# Altium schematic sheet Transceiver.SchDoc
size A4
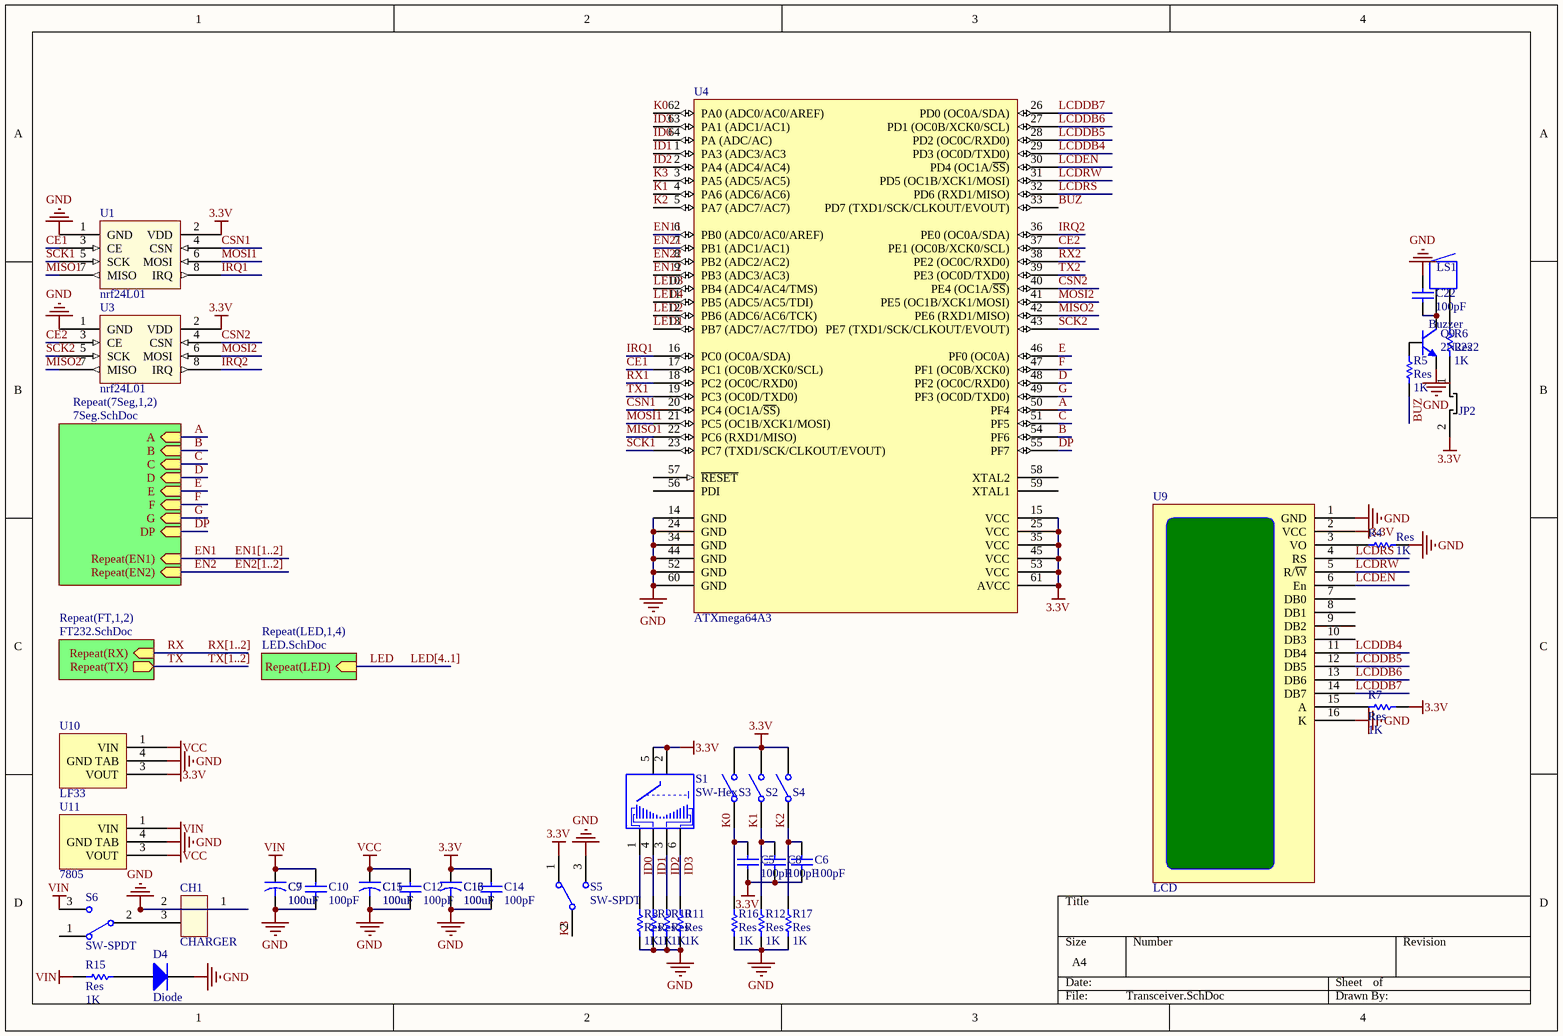
[diagram p0: Transceiver.SchDoc]

## Parts
C5  value 100pF  [2012[0805]]  (hidden comment: Cap_UP)
C6  value 100pF  [2012[0805]]  (hidden comment: Cap_UP)
C7  value 100uF  [EL_M]  (hidden comment: Cap_El)
C8  value 100pF  [2012[0805]]  (hidden comment: Cap_UP)
C9  value 100uF  [EL_M]  (hidden comment: Cap_El)
C10  value 100pF  [2012[0805]]  (hidden comment: Cap_UP)
C11  value 100uF  [EL_M]  (hidden comment: Cap_El)
C12  value 100pF  [2012[0805]]  (hidden comment: Cap_UP)
C13  value 100uF  [EL_M]  (hidden comment: Cap_El)
C14  value 100pF  [2012[0805]]  (hidden comment: Cap_UP)
C15  value 100uF  [EL_M]  (hidden comment: Cap_El)
C16  value 100uF  [EL_M]  (hidden comment: Cap_El)
C22  value 100pF  [2012[0805]]  (hidden comment: Cap_UP)
CH1  CHARGER  [CHARGER]
D4  Diode  [2012[0805]]
JP2  JUMPER  [HDR1X2]  (value not drawn)
LS1  Buzzer  [BUZZER]
Q9  2N2222  [SOT-23]
R4  Res  value 1K  [2012[0805]]
R5  Res  value 1K  [2012[0805]]
R6  Res  value 1K  [2012[0805]]
R7  Res  value 1K  [2012[0805]]
R8  Res  value 1K  [2012[0805]]
R9  Res  value 1K  [2012[0805]]
R10  Res  value 1K  [2012[0805]]
R11  Res  value 1K  [2012[0805]]
R12  Res  value 1K  [2012[0805]]
R15  Res  value 1K  [2012[0805]]
R16  Res  value 1K  [2012[0805]]
R17  Res  value 1K  [2012[0805]]
S1  SW-Hex  [SW-HEX]
S2  SW-SPST  [PUSH-BUT-SMD]  (value not drawn)
S3  SW-SPST  [PUSH-BUT]  (value not drawn)
S4  SW-SPST  [PUSH-BUT]  (value not drawn)
S5  SW-SPDT  [SW-SPDT]
S6  SW-SPDT  [SW-SPDT]
U1  nrf24L01  [NRF24L01+PA+LNA]
U3  nrf24L01  [NRF24L01+PA+LNA]
U4  ATXmega64A3  [64A_N]
U9  LCD  [LCD]
U10  LF33  [D-PACK]
U11  7805  [D-PACK]

## Sub-sheets
Repeat(7Seg,1,2) = 7Seg.SchDoc: A (in), B (in), C (in), D (in), E (in), F (in), G (in), DP (in), Repeat(EN1) (in), Repeat(EN2) (in)
Repeat(FT,1,2) = FT232.SchDoc: Repeat(RX) (in), Repeat(TX) (out)
Repeat(LED,1,4) = LED.SchDoc: Repeat(LED) (in)

## Nets
3.3V: C5.2 C6.2 C8.2 C13.1 C14.2 C16.1 JP2.2 R7.2 S1.2 S1.5 S2.2(NO) S3.2(NO) S4.2(NO) S5.1 U1.2(VDD) U3.2(VDD) U4.15(VCC) U4.25(VCC) U4.35(VCC) U4.45(VCC) U4.53(VCC) U4.61(AVCC) U9.2(VCC) U10.3(VOUT)
GND: C7.2 C9.2 C10.1 C11.2 C12.1 C13.2 C14.1 C15.2 C16.2 C22.2 CH1.1 CH1.2 D4.2(K) Q9.3(E) R4.2 R8.1 R9.1 R10.1 R11.1 R12.1 R16.1 R17.1 S5.3 U1.1(GND) U3.1(GND) U4.14(GND) U4.24(GND) U4.34(GND) U4.44(GND) U4.52(GND) U4.60(GND) U9.1(GND) U9.16(K) U10.4(GND_TAB) U11.4(GND_TAB)
VCC: C11.1 C12.2 C15.1 U10.1(VIN) U11.3(VOUT)
VIN: C7.1 C9.1 C10.2 R15.1 S6.3 U11.1(VIN)
A: U4.50(PF4) ; sheet Repeat(7Seg,1,2)/A
B: U4.54(PF6) ; sheet Repeat(7Seg,1,2)/B
BUZ: R5.2 U4.33(PD7_(TXD1/SCK/CLKOUT/EVOUT))
C: U4.51(PF5) ; sheet Repeat(7Seg,1,2)/C
CE1: U1.3(CE) U4.17(PC1_(OC0B/XCK0/SCL))
CE2: U3.3(CE) U4.37(PE1_(OC0B/XCK0/SCL))
CSN1: U1.4(CSN) U4.20(PC4_(OC1A/~{SS}))
CSN2: U3.4(CSN) U4.40(PE4_(OC1A/~{SS}))
D: U4.48(PF2_(OC0C/RXD0)) ; sheet Repeat(7Seg,1,2)/D
DP: U4.55(PF7) ; sheet Repeat(7Seg,1,2)/DP
E: U4.46(PF0_(OC0A)) ; sheet Repeat(7Seg,1,2)/E
EN1: sheet Repeat(7Seg,1,2)/Repeat(EN1)
EN2: sheet Repeat(7Seg,1,2)/Repeat(EN2)
EN11: U4.6(PB0_(ADC0/AC0/AREF))
EN12: U4.9(PB3_(ADC3/AC3))
EN21: U4.7(PB1_(ADC1/AC1))
EN22: U4.8(PB2_(ADC2/AC2))
F: U4.47(PF1_(OC0B/XCK0)) ; sheet Repeat(7Seg,1,2)/F
G: U4.49(PF3_(OC0D/TXD0)) ; sheet Repeat(7Seg,1,2)/G
ID0: R8.2 S1.1 U4.64(PA_(ADC/AC))
ID1: R9.2 S1.4 U4.1(PA3_(ADC3/AC3)
ID2: R10.2 S1.3 U4.2(PA4_(ADC4/AC4))
ID3: R11.2 S1.6 U4.63(PA1_(ADC1/AC1))
IRQ1: U1.8(IRQ) U4.16(PC0_(OC0A/SDA))
IRQ2: U3.8(IRQ) U4.36(PE0_(OC0A/SDA))
K0: C5.1 R16.2 S3.1(COMMON) U4.62(PA0_(ADC0/AC0/AREF))
K1: C8.1 R12.2 S2.1(COMMON) U4.4(PA6_(ADC6/AC6))
K2: C6.1 R17.2 S4.1(COMMON) U4.5(PA7_(ADC7/AC7))
K3: S5.2 U4.3(PA5_(ADC5/AC5))
LCDDB4: U4.29(PD3_(OC0D/TXD0)) U9.11(DB4)
LCDDB5: U4.28(PD2_(OC0C/RXD0)) U9.12(DB5)
LCDDB6: U4.27(PD1_(OC0B/XCK0/SCL)) U9.13(DB6)
LCDDB7: U4.26(PD0_(OC0A/SDA)) U9.14(DB7)
LCDEN: U4.30(PD4_(OC1A/~{SS})) U9.6(En)
LCDRS: U4.32(PD6_(RXD1/MISO)) U9.4(RS)
LCDRW: U4.31(PD5_(OC1B/XCK1/MOSI)) U9.5(R/~{W})
LED: sheet Repeat(LED,1,4)/Repeat(LED)
LED1: U4.13(PB7_(ADC7/AC7/TDO))
LED2: U4.12(PB6_(ADC6/AC6/TCK))
LED3: U4.10(PB4_(ADC4/AC4/TMS))
LED4: U4.11(PB5_(ADC5/AC5/TDI))
MISO1: U1.7(MISO) U4.22(PC6_(RXD1/MISO))
MISO2: U3.7(MISO) U4.42(PE6_(RXD1/MISO))
MOSI1: U1.6(MOSI) U4.21(PC5_(OC1B/XCK1/MOSI))
MOSI2: U3.6(MOSI) U4.41(PE5_(OC1B/XCK1/MOSI))
RX: sheet Repeat(FT,1,2)/Repeat(RX)
RX1: U4.18(PC2_(OC0C/RXD0))
RX2: U4.38(PE2_(OC0C/RXD0))
SCK1: U1.5(SCK) U4.23(PC7_(TXD1/SCK/CLKOUT/EVOUT))
SCK2: U3.5(SCK) U4.43(PE7_(TXD1/SCK/CLKOUT/EVOUT))
TX: sheet Repeat(FT,1,2)/Repeat(TX)
TX1: U4.19(PC3_(OC0D/TXD0))
TX2: U4.39(PE3_(OC0D/TXD0))
NetC22_1: C22.1 LS1.1 Q9.1(C)
NetCH1_3: CH1.3 S6.2
NetD4_1: D4.1(A) R15.2
NetJP2_1: JP2.1 R6.2
NetLS1_2: LS1.2 R6.1
NetQ9_2: Q9.2(B) R5.1
NetR4_1: R4.1 U9.3(VO)
NetR7_1: R7.1 U9.15(A)

Not connected (* = marked no-connect by the designer): S6 1(3); U4 56(PDI) 57(~{RESET}) 58(XTAL2) 59(XTAL1); U9 7(DB0) 8(DB1) 9(DB2) 10(DB3)

## Buses and harness runs
bus EN1[1..2]
bus EN2[1..2]
bus LED[4..1]
bus RX[1..2]
bus TX[1..2]

## Library data of the parts
C5 C6 C8 C10 C12 C14 C22 = Cap_UP: Capacitor; Published: 8-Jun-2000; LatestRevisionDate: 17-Jul-2002; LatestRevisionNote: Re-released for DXP Platform.; PackageReference: RAD-0.3; Publisher: Altium Limited
C7 C9 C11 C13 C15 C16 = Cap_El: Capacitor; Published: 23-Sep-2002; PackageReference: CAPR5-4X5; Publisher: Altium Limited
D4 = Diode: 1 Amp General Purpose Rectifier; Revision 1: 11-Jul-2000: SIM Model Added.; Revision 2: 17-Jul-2002: Re-released for DXP Platform.; Package Information: Latest Revision: Aug-1999; Code - JEDEC: DO-204-AL; Published: 8-Jun-2000; Datasheet: Latest Revision: 1998; Package Reference: DO-41; Publisher: Altium Limited
LS1 = Buzzer: Magnetic Transducer Buzzer; Published: 24-Mar-1999; LatestRevisionDate: 17-Dec-2003; LatestRevisionNote: Schematic revised, PCB Footprint replaced.; DatasheetDocument: 17-Dec-2003; PackageReference: ABSM-1574; Publisher: Altium Limited; ComponentLink1Description: Manufacturer Link; ComponentLink1URL: http://www.megastar.com/linecard/buzzmode/index.php
Q9 = 2N2222: NPN Bipolar Transistor; Published: 8-Jun-2000; LatestRevisionDate: 17-Jul-2002; LatestRevisionNote: Re-released for DXP Platform.; PackageReference: TO-226; Publisher: Altium Limited; Code_JEDEC: TO-226-AA
R4-R12 R15-R17 = Res: Semiconductor Resistor; Published: 8-Jun-2000; LatestRevisionDate: 17-Jul-2002; LatestRevisionNote: Re-released for DXP Platform.; PackageReference: AXIAL-0.5; Publisher: Altium Limited
S2-S4 = SW-SPST: Single-Pole, Single-Throw Switch; Published: 24-Mar-1999; Revision: July-2002: Re-released for DXP Platform.; Publisher: Altium Limited
S5 S6 = SW-SPDT: SPDT Subminiature Toggle Switch, Right Angle Mounting, Vertical Actuation; Published: 24-Mar-1999; LatestRevisionDate: 17-Dec-2003; LatestRevisionNote: Schematic revised, PCB Footprint replaced.; DatasheetDocument: 05-Dec-2000; PackageReference: TL36WW15050; Publisher: Altium Limited; ComponentLink1Description: Manufacturer Link; ComponentLink1URL: http://www.apem.com
U9 = LCD: LCD 2X16
U10 = 7805
S1 = SW-Hex: Published: 24-Mar-1999; LatestRevisionDate: 17-Jul-2002; LatestRevisionNote: Re-released for DXP Platform.; PackageReference: DIP-8; Publisher: Altium Limited